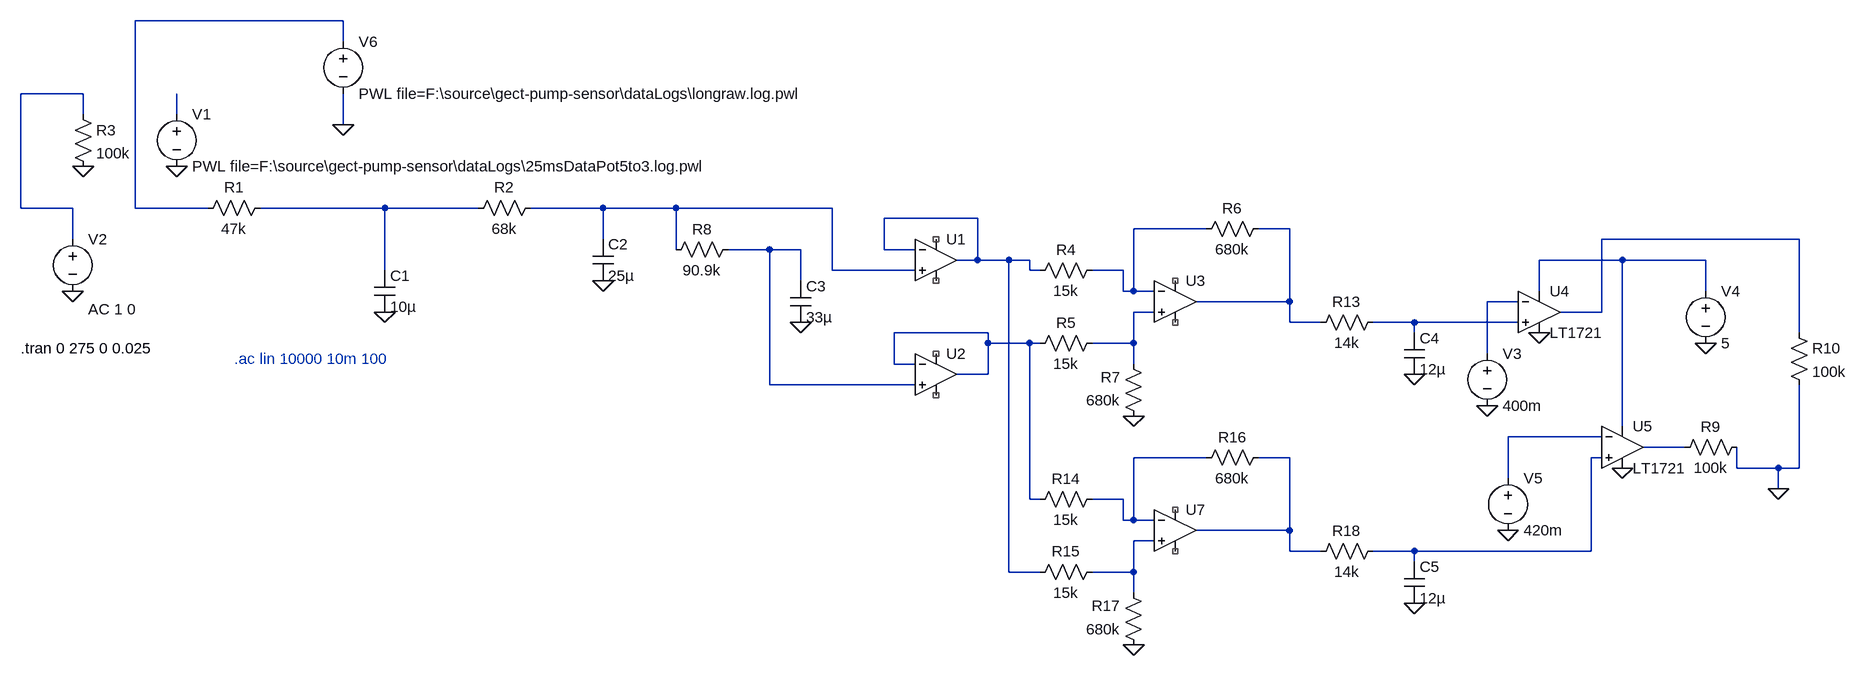
[diagram p0: schematic RC sim.asc]
RC sim.asc, the LTspice schematic file:
Version 4
SHEET 1 3312 772
WIRE 560 -288 240 -288
WIRE 560 -256 560 -288
WIRE 160 -176 64 -176
WIRE 160 -144 160 -176
WIRE 304 -144 304 -176
WIRE 560 -128 560 -176
WIRE 64 0 64 -176
WIRE 144 0 64 0
WIRE 240 0 240 -288
WIRE 352 0 240 0
WIRE 624 0 432 0
WIRE 768 0 624 0
WIRE 960 0 848 0
WIRE 1072 0 960 0
WIRE 1312 0 1072 0
WIRE 1536 16 1392 16
WIRE 1888 32 1776 32
WIRE 2016 32 1968 32
WIRE 144 48 144 0
WIRE 960 48 960 0
WIRE 2800 48 2496 48
WIRE 1072 64 1072 0
WIRE 1216 64 1152 64
WIRE 1264 64 1216 64
WIRE 1392 64 1392 16
WIRE 1440 64 1392 64
WIRE 1536 80 1536 16
WIRE 1536 80 1504 80
WIRE 1584 80 1536 80
WIRE 1616 80 1584 80
WIRE 2528 80 2400 80
WIRE 2656 80 2528 80
WIRE 624 96 624 0
WIRE 1312 96 1312 0
WIRE 1440 96 1312 96
WIRE 1616 96 1616 80
WIRE 1632 96 1616 96
WIRE 1760 96 1712 96
WIRE 1264 112 1264 64
WIRE 1760 128 1760 96
WIRE 1776 128 1776 32
WIRE 1776 128 1760 128
WIRE 1808 128 1776 128
WIRE 2400 128 2400 80
WIRE 2656 128 2656 80
WIRE 2016 144 2016 32
WIRE 2016 144 1872 144
WIRE 2368 144 2320 144
WIRE 1808 160 1776 160
WIRE 2496 160 2496 48
WIRE 2496 160 2432 160
WIRE 2016 176 2016 144
WIRE 2064 176 2016 176
WIRE 2208 176 2144 176
WIRE 2368 176 2208 176
WIRE 1552 192 1408 192
WIRE 2208 192 2208 176
WIRE 2800 192 2800 48
WIRE 1552 208 1552 192
WIRE 1616 208 1552 208
WIRE 1632 208 1616 208
WIRE 1776 208 1776 160
WIRE 1776 208 1712 208
WIRE 2320 224 2320 144
WIRE 1408 240 1408 192
WIRE 1440 240 1408 240
WIRE 1776 240 1776 208
WIRE 1552 256 1552 208
WIRE 1552 256 1504 256
WIRE 1216 272 1216 64
WIRE 1440 272 1216 272
WIRE 2528 336 2528 80
WIRE 2496 352 2352 352
WIRE 2624 368 2560 368
WIRE 1888 384 1776 384
WIRE 2016 384 1968 384
WIRE 2496 384 2480 384
WIRE 2704 400 2704 368
WIRE 2768 400 2704 400
WIRE 2800 400 2800 272
WIRE 2800 400 2768 400
WIRE 2352 416 2352 352
WIRE 2768 432 2768 400
WIRE 1616 448 1616 208
WIRE 1632 448 1616 448
WIRE 1760 448 1712 448
WIRE 1760 480 1760 448
WIRE 1776 480 1776 384
WIRE 1776 480 1760 480
WIRE 1808 480 1776 480
WIRE 2016 496 2016 384
WIRE 2016 496 1872 496
WIRE 1808 512 1776 512
WIRE 2016 528 2016 496
WIRE 2064 528 2016 528
WIRE 2208 528 2144 528
WIRE 2480 528 2480 384
WIRE 2480 528 2208 528
WIRE 2208 544 2208 528
WIRE 1584 560 1584 80
WIRE 1632 560 1584 560
WIRE 1776 560 1776 512
WIRE 1776 560 1712 560
WIRE 1776 592 1776 560
FLAG 304 -64 0
FLAG 624 160 0
FLAG 960 112 0
FLAG 144 128 0
FLAG 160 -64 0
FLAG 1776 320 0
FLAG 1264 176 0
FLAG 2320 304 0
FLAG 2656 208 0
FLAG 2400 192 0
FLAG 2352 496 0
FLAG 2528 400 0
FLAG 2768 432 0
FLAG 2208 256 0
FLAG 560 -128 0
FLAG 1776 672 0
FLAG 2208 608 0
SYMBOL voltage 304 -160 R0
WINDOW 123 0 0 Left 0
WINDOW 39 0 0 Left 0
SYMATTR InstName V1
SYMATTR Value PWL file=F:\source\gect-pump-sensor\dataLogs\25msDataPot5to3.log.pwl
SYMBOL cap 608 96 R0
SYMATTR InstName C1
SYMATTR Value 10µ
SYMBOL res 448 -16 R90
WINDOW 0 0 56 VBottom 2
WINDOW 3 32 56 VTop 2
SYMATTR InstName R1
SYMATTR Value 47k
SYMBOL res 864 -16 R90
WINDOW 0 0 56 VBottom 2
WINDOW 3 32 56 VTop 2
SYMATTR InstName R2
SYMATTR Value 68k
SYMBOL cap 944 48 R0
SYMATTR InstName C2
SYMATTR Value 25µ
SYMBOL voltage 144 32 R0
WINDOW 123 24 124 Left 2
WINDOW 39 0 0 Left 0
SYMATTR Value2 AC 1 0
SYMATTR InstName V2
SYMATTR Value ""
SYMBOL res 144 -160 R0
SYMATTR InstName R3
SYMATTR Value 100k
SYMBOL OpAmps\\UniversalOpamp2 1472 80 R0
SYMATTR InstName U1
SYMATTR SpiceModel level.1
SYMBOL OpAmps\\UniversalOpamp2 1472 256 R0
SYMATTR InstName U2
SYMATTR SpiceModel level.1
SYMBOL OpAmps\\UniversalOpamp2 1840 144 R0
SYMATTR InstName U3
SYMATTR SpiceModel level.1
SYMBOL res 1728 80 R90
WINDOW 0 0 56 VBottom 2
WINDOW 3 32 56 VTop 2
SYMATTR InstName R4
SYMATTR Value 15k
SYMBOL res 1728 192 R90
WINDOW 0 0 56 VBottom 2
WINDOW 3 32 56 VTop 2
SYMATTR InstName R5
SYMATTR Value 15k
SYMBOL res 1984 16 R90
WINDOW 0 0 56 VBottom 2
WINDOW 3 32 56 VTop 2
SYMATTR InstName R6
SYMATTR Value 680k
SYMBOL res 1792 336 R180
WINDOW 0 36 76 Left 2
WINDOW 3 36 40 Left 2
SYMATTR InstName R7
SYMATTR Value 680k
SYMBOL res 1168 48 R90
WINDOW 0 0 56 VBottom 2
WINDOW 3 32 56 VTop 2
SYMATTR InstName R8
SYMATTR Value 90.9k
SYMBOL cap 1248 112 R0
SYMATTR InstName C3
SYMATTR Value 33µ
SYMBOL Comparators\\LT1721 2400 96 R0
SYMATTR InstName U4
SYMBOL voltage 2320 208 R0
WINDOW 123 0 0 Left 0
WINDOW 39 0 0 Left 0
SYMATTR InstName V3
SYMATTR Value 400m
SYMBOL voltage 2656 112 R0
WINDOW 123 0 0 Left 0
WINDOW 39 0 0 Left 0
SYMATTR InstName V4
SYMATTR Value 5
SYMBOL Comparators\\LT1721 2528 304 R0
SYMATTR InstName U5
SYMBOL voltage 2352 400 R0
WINDOW 123 0 0 Left 0
WINDOW 39 0 0 Left 0
SYMATTR InstName V5
SYMATTR Value 420m
SYMBOL res 2608 384 R270
WINDOW 0 32 56 VTop 2
WINDOW 3 0 56 VBottom 2
SYMATTR InstName R9
SYMATTR Value 100k
SYMBOL res 2784 176 R0
SYMATTR InstName R10
SYMATTR Value 100k
SYMBOL cap 2192 192 R0
SYMATTR InstName C4
SYMATTR Value 12µ
SYMBOL res 2160 160 R90
WINDOW 0 0 56 VBottom 2
WINDOW 3 32 56 VTop 2
SYMATTR InstName R13
SYMATTR Value 14k
SYMBOL voltage 560 -272 R0
WINDOW 123 0 0 Left 0
WINDOW 39 0 0 Left 0
SYMATTR InstName V6
SYMATTR Value PWL file=F:\source\gect-pump-sensor\dataLogs\longraw.log.pwl
SYMBOL OpAmps\\UniversalOpamp2 1840 496 R0
SYMATTR InstName U7
SYMATTR SpiceModel level.1
SYMBOL res 1728 432 R90
WINDOW 0 0 56 VBottom 2
WINDOW 3 32 56 VTop 2
SYMATTR InstName R14
SYMATTR Value 15k
SYMBOL res 1728 544 R90
WINDOW 0 0 56 VBottom 2
WINDOW 3 32 56 VTop 2
SYMATTR InstName R15
SYMATTR Value 15k
SYMBOL res 1984 368 R90
WINDOW 0 0 56 VBottom 2
WINDOW 3 32 56 VTop 2
SYMATTR InstName R16
SYMATTR Value 680k
SYMBOL res 1792 688 R180
WINDOW 0 36 76 Left 2
WINDOW 3 36 40 Left 2
SYMATTR InstName R17
SYMATTR Value 680k
SYMBOL cap 2192 544 R0
SYMATTR InstName C5
SYMATTR Value 12µ
SYMBOL res 2160 512 R90
WINDOW 0 0 56 VBottom 2
WINDOW 3 32 56 VTop 2
SYMATTR InstName R18
SYMATTR Value 14k
TEXT 64 216 Left 2 !.tran 0 275 0 0.025
TEXT 392 232 Left 2 ;.ac lin 10000 10m 100

The netlist it stands for:
* RC sim.asc
V1 N003 0 PWL file=F:\source\gect-pump-sensor\dataLogs\25msDataPot5to3.log.pwl
C1 N004 0 10µ
R1 N004 N001 47k
R2 N005 N004 68k
C2 N005 0 25µ
V2 N002 0 AC 1 0
R3 N002 0 100k
XU1 N005 N006 NC_01 NC_02 N006 level.1 Avol=1Meg GBW=10Meg Slew=10Meg ilimit=25m rail=0 Vos=0 phimargin=45 en=0 enk=0 in=0 ink=0 Rin=500Meg  ; pins IN+ IN- V+ V- OUT
XU2 N010 N015 NC_03 NC_04 N015 level.1 Avol=1Meg GBW=10Meg Slew=10Meg ilimit=25m rail=0 Vos=0 phimargin=45 en=0 enk=0 in=0 ink=0 Rin=500Meg  ; pins IN+ IN- V+ V- OUT
XU3 N013 N007 NC_05 NC_06 N008 level.1 Avol=1Meg GBW=10Meg Slew=10Meg ilimit=25m rail=0 Vos=0 phimargin=45 en=0 enk=0 in=0 ink=0 Rin=500Meg  ; pins IN+ IN- V+ V- OUT
R4 N007 N006 15k
R5 N013 N015 15k
R6 N008 N007 680k
R7 0 N013 680k
R8 N010 N005 90.9k
C3 N010 0 33µ
XU4 N014 N012 N011 0 N009 LT1720  ; LT1721, pins In+ In- V+ V- OUT
V3 N012 0 400m
V4 N011 0 5
XU5 N020 N016 N011 0 N017 LT1720  ; LT1721, pins In+ In- V+ V- OUT
V5 N016 0 420m
R9 N017 0 100k
R10 N009 0 100k
C4 N014 0 12µ
R13 N014 N008 14k
V6 N001 0 PWL file=F:\source\gect-pump-sensor\dataLogs\longraw.log.pwl
XU7 N021 N018 NC_07 NC_08 N019 level.1 Avol=1Meg GBW=10Meg Slew=10Meg ilimit=25m rail=0 Vos=0 phimargin=45 en=0 enk=0 in=0 ink=0 Rin=500Meg  ; pins IN+ IN- V+ V- OUT
R14 N018 N015 15k
R15 N021 N006 15k
R16 N019 N018 680k
R17 0 N021 680k
C5 N020 0 12µ
R18 N020 N019 14k
.tran 0 275 0 0.025
* .ac lin 10000 10m 100
.lib UniversalOpamps2.sub
.lib LTC.lib
.backanno
.end